# EAGLE schematic 404_led_matrix (EAGLE 7.5.0)
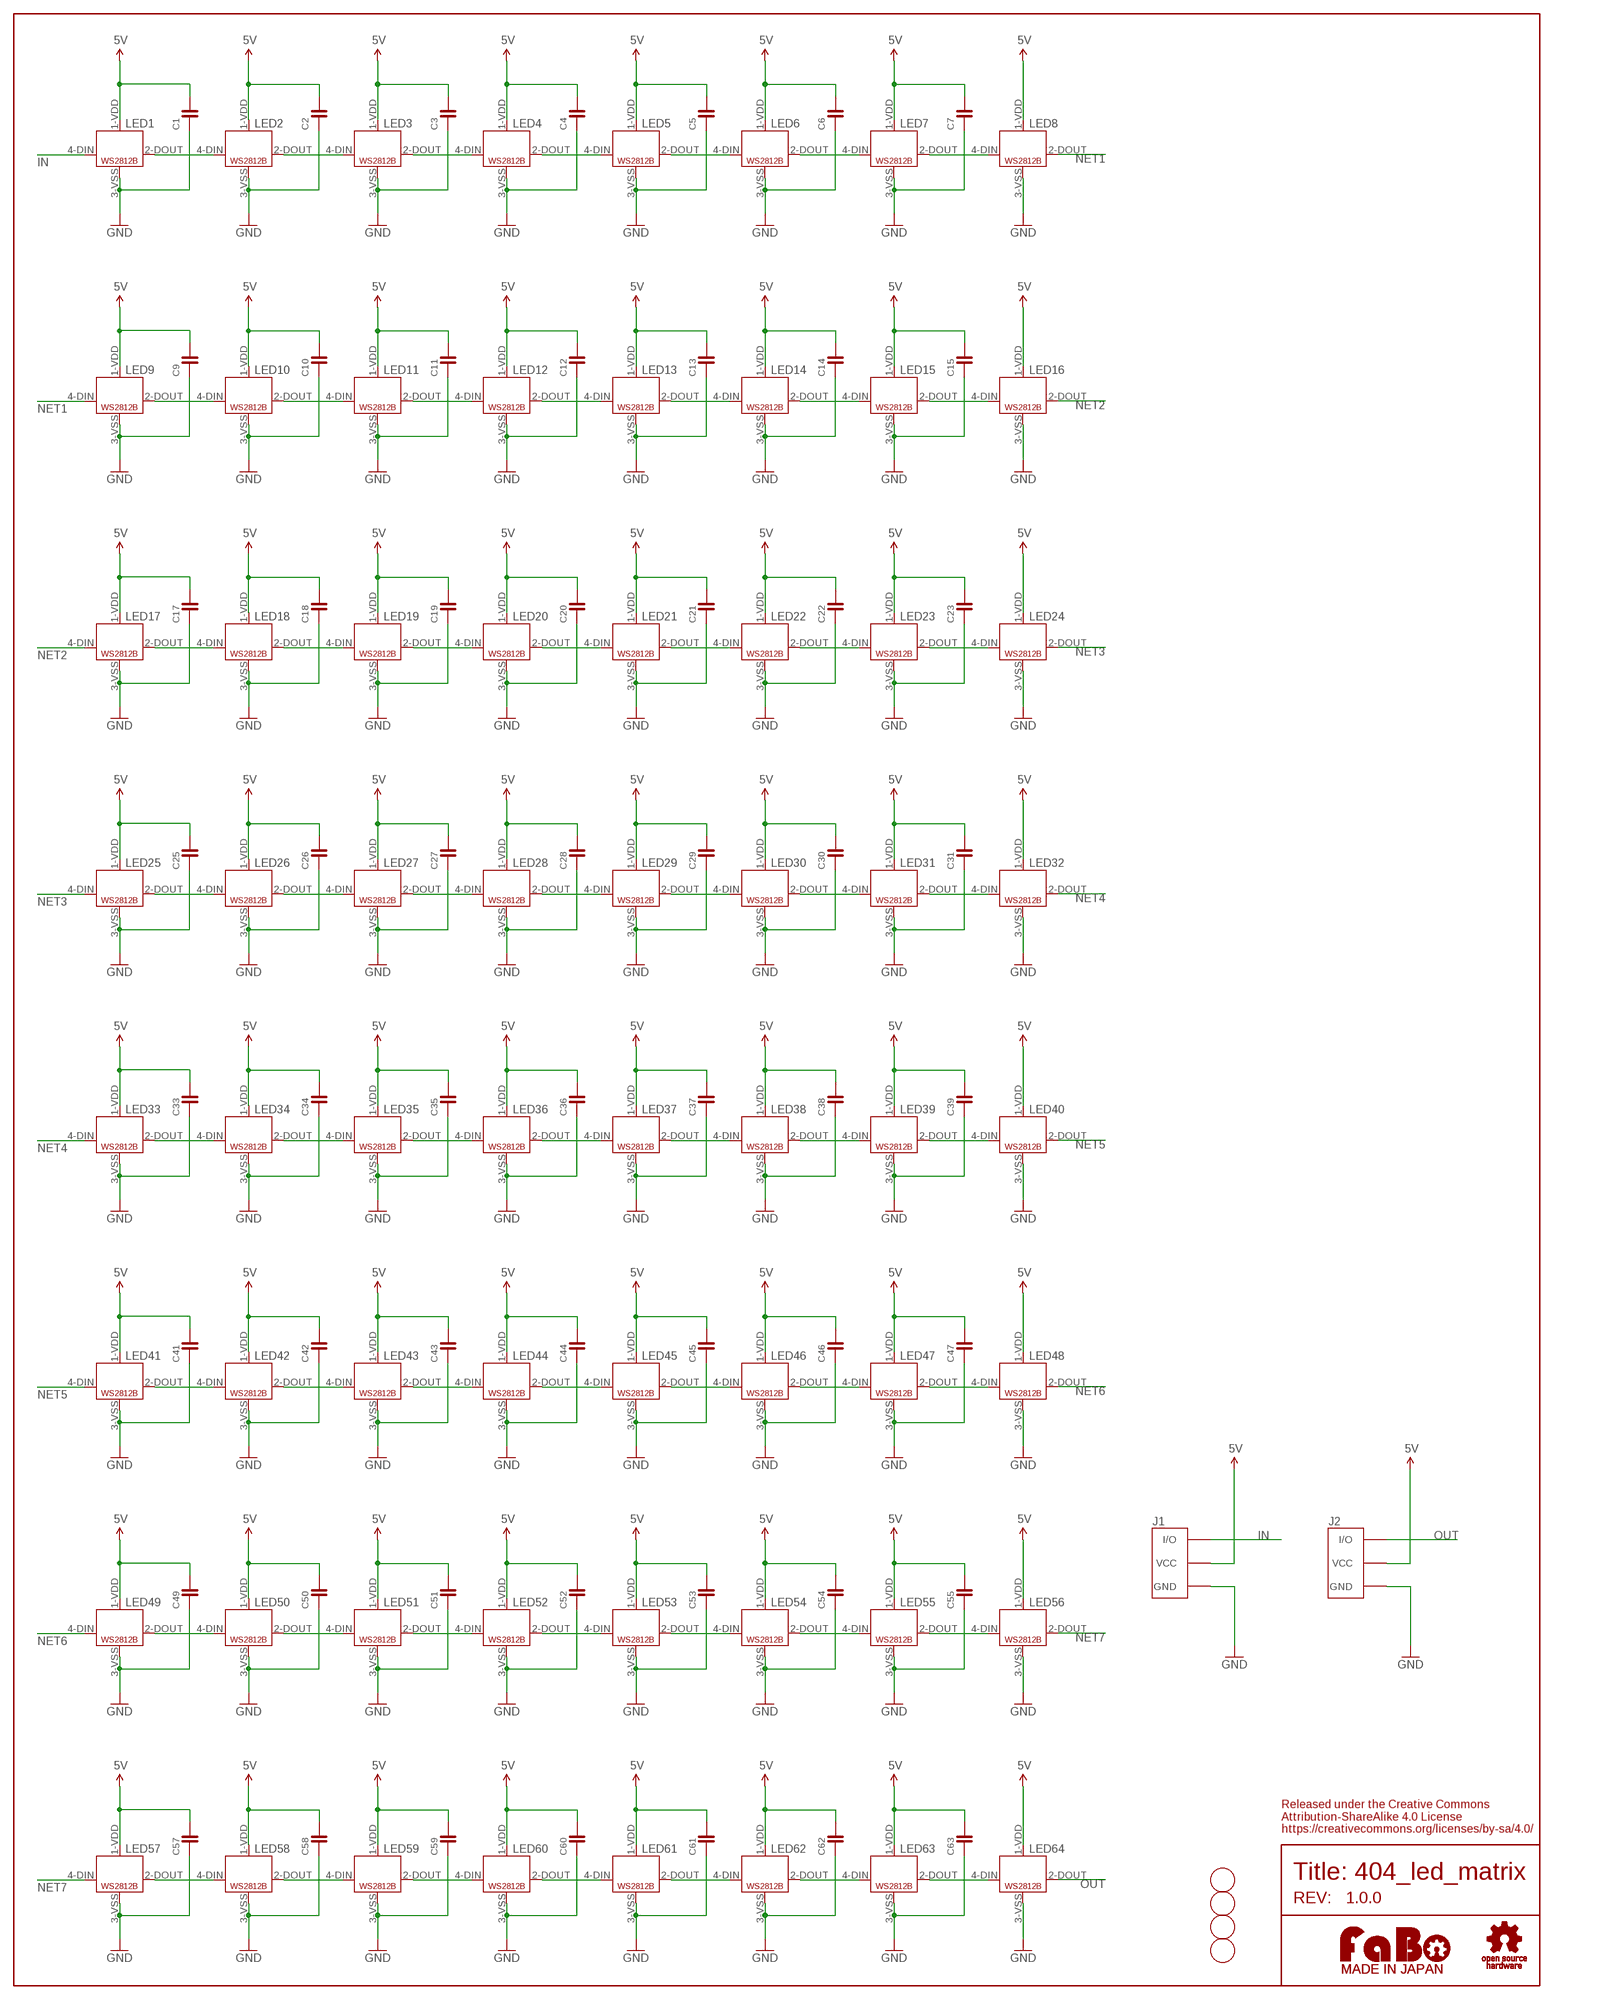
[diagram p0: schematic, sheet 1]

## Parts
C1  CAPACITOR-0603  [0603]
C2  CAPACITOR-0603  [0603]
C3  CAPACITOR-0603  [0603]
C4  CAPACITOR-0603  [0603]
C5  CAPACITOR-0603  [0603]
C6  CAPACITOR-0603  [0603]
C7  CAPACITOR-0603  [0603]
C9  CAPACITOR-0603  [0603]
C10  CAPACITOR-0603  [0603]
C11  CAPACITOR-0603  [0603]
C12  CAPACITOR-0603  [0603]
C13  CAPACITOR-0603  [0603]
C14  CAPACITOR-0603  [0603]
C15  CAPACITOR-0603  [0603]
C17  CAPACITOR-0603  [0603]
C18  CAPACITOR-0603  [0603]
C19  CAPACITOR-0603  [0603]
C20  CAPACITOR-0603  [0603]
C21  CAPACITOR-0603  [0603]
C22  CAPACITOR-0603  [0603]
C23  CAPACITOR-0603  [0603]
C25  CAPACITOR-0603  [0603]
C26  CAPACITOR-0603  [0603]
C27  CAPACITOR-0603  [0603]
C28  CAPACITOR-0603  [0603]
C29  CAPACITOR-0603  [0603]
C30  CAPACITOR-0603  [0603]
C31  CAPACITOR-0603  [0603]
C33  CAPACITOR-0603  [0603]
C34  CAPACITOR-0603  [0603]
C35  CAPACITOR-0603  [0603]
C36  CAPACITOR-0603  [0603]
C37  CAPACITOR-0603  [0603]
C38  CAPACITOR-0603  [0603]
C39  CAPACITOR-0603  [0603]
C41  CAPACITOR-0603  [0603]
C42  CAPACITOR-0603  [0603]
C43  CAPACITOR-0603  [0603]
C44  CAPACITOR-0603  [0603]
C45  CAPACITOR-0603  [0603]
C46  CAPACITOR-0603  [0603]
C47  CAPACITOR-0603  [0603]
C49  CAPACITOR-0603  [0603]
C50  CAPACITOR-0603  [0603]
C51  CAPACITOR-0603  [0603]
C52  CAPACITOR-0603  [0603]
C53  CAPACITOR-0603  [0603]
C54  CAPACITOR-0603  [0603]
C55  CAPACITOR-0603  [0603]
C57  CAPACITOR-0603  [0603]
C58  CAPACITOR-0603  [0603]
C59  CAPACITOR-0603  [0603]
C60  CAPACITOR-0603  [0603]
C61  CAPACITOR-0603  [0603]
C62  CAPACITOR-0603  [0603]
C63  CAPACITOR-0603  [0603]
HOLE1  SCREW-PAD-2.8MM  [SCREWPAD_2.8MM]
HOLE2  SCREW-PAD-2.8MM  [SCREWPAD_2.8MM]
HOLE3  SCREW-PAD-2.8MM  [SCREWPAD_2.8MM]
HOLE4  SCREW-PAD-2.8MM  [SCREWPAD_2.8MM]
J1  FABO_BRICK_3PIN-CONNECTOR_NARROW  [FABO_BRICK_3PIN_CONNECTOR_NARROW]
J2  FABO_BRICK_3PIN-S03B-PASK-2  [FABO_BRICK_3PIN_S03B-PASK-2]
LED1  WS2812B_NARROW  [WS2812B_NARROW]
LED2  WS2812B_NARROW  [WS2812B_NARROW]
LED3  WS2812B_NARROW  [WS2812B_NARROW]
LED4  WS2812B_NARROW  [WS2812B_NARROW]
LED5  WS2812B_NARROW  [WS2812B_NARROW]
LED6  WS2812B_NARROW  [WS2812B_NARROW]
LED7  WS2812B_NARROW  [WS2812B_NARROW]
LED8  WS2812B_NARROW  [WS2812B_NARROW]
LED9  WS2812B_NARROW  [WS2812B_NARROW]
LED10  WS2812B_NARROW  [WS2812B_NARROW]
LED11  WS2812B_NARROW  [WS2812B_NARROW]
LED12  WS2812B_NARROW  [WS2812B_NARROW]
LED13  WS2812B_NARROW  [WS2812B_NARROW]
LED14  WS2812B_NARROW  [WS2812B_NARROW]
LED15  WS2812B_NARROW  [WS2812B_NARROW]
LED16  WS2812B_NARROW  [WS2812B_NARROW]
LED17  WS2812B_NARROW  [WS2812B_NARROW]
LED18  WS2812B_NARROW  [WS2812B_NARROW]
LED19  WS2812B_NARROW  [WS2812B_NARROW]
LED20  WS2812B_NARROW  [WS2812B_NARROW]
LED21  WS2812B_NARROW  [WS2812B_NARROW]
LED22  WS2812B_NARROW  [WS2812B_NARROW]
LED23  WS2812B_NARROW  [WS2812B_NARROW]
LED24  WS2812B_NARROW  [WS2812B_NARROW]
LED25  WS2812B_NARROW  [WS2812B_NARROW]
LED26  WS2812B_NARROW  [WS2812B_NARROW]
LED27  WS2812B_NARROW  [WS2812B_NARROW]
LED28  WS2812B_NARROW  [WS2812B_NARROW]
LED29  WS2812B_NARROW  [WS2812B_NARROW]
LED30  WS2812B_NARROW  [WS2812B_NARROW]
LED31  WS2812B_NARROW  [WS2812B_NARROW]
LED32  WS2812B_NARROW  [WS2812B_NARROW]
LED33  WS2812B_NARROW  [WS2812B_NARROW]
LED34  WS2812B_NARROW  [WS2812B_NARROW]
LED35  WS2812B_NARROW  [WS2812B_NARROW]
LED36  WS2812B_NARROW  [WS2812B_NARROW]
LED37  WS2812B_NARROW  [WS2812B_NARROW]
LED38  WS2812B_NARROW  [WS2812B_NARROW]
LED39  WS2812B_NARROW  [WS2812B_NARROW]
LED40  WS2812B_NARROW  [WS2812B_NARROW]
LED41  WS2812B_NARROW  [WS2812B_NARROW]
LED42  WS2812B_NARROW  [WS2812B_NARROW]
LED43  WS2812B_NARROW  [WS2812B_NARROW]
LED44  WS2812B_NARROW  [WS2812B_NARROW]
LED45  WS2812B_NARROW  [WS2812B_NARROW]
LED46  WS2812B_NARROW  [WS2812B_NARROW]
LED47  WS2812B_NARROW  [WS2812B_NARROW]
LED48  WS2812B_NARROW  [WS2812B_NARROW]
LED49  WS2812B_NARROW  [WS2812B_NARROW]
LED50  WS2812B_NARROW  [WS2812B_NARROW]
LED51  WS2812B_NARROW  [WS2812B_NARROW]
LED52  WS2812B_NARROW  [WS2812B_NARROW]
LED53  WS2812B_NARROW  [WS2812B_NARROW]
LED54  WS2812B_NARROW  [WS2812B_NARROW]
LED55  WS2812B_NARROW  [WS2812B_NARROW]
LED56  WS2812B_NARROW  [WS2812B_NARROW]
LED57  WS2812B_NARROW  [WS2812B_NARROW]
LED58  WS2812B_NARROW  [WS2812B_NARROW]
LED59  WS2812B_NARROW  [WS2812B_NARROW]
LED60  WS2812B_NARROW  [WS2812B_NARROW]
LED61  WS2812B_NARROW  [WS2812B_NARROW]
LED62  WS2812B_NARROW  [WS2812B_NARROW]
LED63  WS2812B_NARROW  [WS2812B_NARROW]
LED64  WS2812B_NARROW  [WS2812B_NARROW]
U$1  LOGO_OSHW-T_M_BOTTOM  [LOGO_OSHW_T_MS_BOTTOM]
U$2  LOGO_FABO-L_BOTTOM  [LOGO_FABO_L_BOTTOM]
U$4  LOGO_FABO-S  [LOGO_FABO_S]

## Nets
5V: C1.2 C2.2 C3.2 C4.2 C5.2 C6.2 C7.2 C9.2 C10.2 C11.2 C12.2 C13.2 C14.2 C15.2 C17.2 C18.2 C19.2 C20.2 C21.2 C22.2 C23.2 C25.2 C26.2 C27.2 C28.2 C29.2 C30.2 C31.2 C33.2 C34.2 C35.2 C36.2 C37.2 C38.2 C39.2 C41.2 C42.2 C43.2 C44.2 C45.2 C46.2 C47.2 C49.2 C50.2 C51.2 C52.2 C53.2 C54.2 C55.2 C57.2 C58.2 C59.2 C60.2 C61.2 C62.2 C63.2 J1.VCC J2.VCC LED1.1-VDD(VDD) LED2.1-VDD(VDD) LED3.1-VDD(VDD) LED4.1-VDD(VDD) LED5.1-VDD(VDD) LED6.1-VDD(VDD) LED7.1-VDD(VDD) LED8.1-VDD(VDD) LED9.1-VDD(VDD) LED10.1-VDD(VDD) LED11.1-VDD(VDD) LED12.1-VDD(VDD) LED13.1-VDD(VDD) LED14.1-VDD(VDD) LED15.1-VDD(VDD) LED16.1-VDD(VDD) LED17.1-VDD(VDD) LED18.1-VDD(VDD) LED19.1-VDD(VDD) LED20.1-VDD(VDD) LED21.1-VDD(VDD) LED22.1-VDD(VDD) LED23.1-VDD(VDD) LED24.1-VDD(VDD) LED25.1-VDD(VDD) LED26.1-VDD(VDD) LED27.1-VDD(VDD) LED28.1-VDD(VDD) LED29.1-VDD(VDD) LED30.1-VDD(VDD) LED31.1-VDD(VDD) LED32.1-VDD(VDD) LED33.1-VDD(VDD) LED34.1-VDD(VDD) LED35.1-VDD(VDD) LED36.1-VDD(VDD) LED37.1-VDD(VDD) LED38.1-VDD(VDD) LED39.1-VDD(VDD) LED40.1-VDD(VDD) LED41.1-VDD(VDD) LED42.1-VDD(VDD) LED43.1-VDD(VDD) LED44.1-VDD(VDD) LED45.1-VDD(VDD) LED46.1-VDD(VDD) LED47.1-VDD(VDD) LED48.1-VDD(VDD) LED49.1-VDD(VDD) LED50.1-VDD(VDD) LED51.1-VDD(VDD) LED52.1-VDD(VDD) LED53.1-VDD(VDD) LED54.1-VDD(VDD) LED55.1-VDD(VDD) LED56.1-VDD(VDD) LED57.1-VDD(VDD) LED58.1-VDD(VDD) LED59.1-VDD(VDD) LED60.1-VDD(VDD) LED61.1-VDD(VDD) LED62.1-VDD(VDD) LED63.1-VDD(VDD) LED64.1-VDD(VDD)
GND: C1.1 C2.1 C3.1 C4.1 C5.1 C6.1 C7.1 C9.1 C10.1 C11.1 C12.1 C13.1 C14.1 C15.1 C17.1 C18.1 C19.1 C20.1 C21.1 C22.1 C23.1 C25.1 C26.1 C27.1 C28.1 C29.1 C30.1 C31.1 C33.1 C34.1 C35.1 C36.1 C37.1 C38.1 C39.1 C41.1 C42.1 C43.1 C44.1 C45.1 C46.1 C47.1 C49.1 C50.1 C51.1 C52.1 C53.1 C54.1 C55.1 C57.1 C58.1 C59.1 C60.1 C61.1 C62.1 C63.1 J1.GND J2.GND LED1.3-VSS(VSS) LED2.3-VSS(VSS) LED3.3-VSS(VSS) LED4.3-VSS(VSS) LED5.3-VSS(VSS) LED6.3-VSS(VSS) LED7.3-VSS(VSS) LED8.3-VSS(VSS) LED9.3-VSS(VSS) LED10.3-VSS(VSS) LED11.3-VSS(VSS) LED12.3-VSS(VSS) LED13.3-VSS(VSS) LED14.3-VSS(VSS) LED15.3-VSS(VSS) LED16.3-VSS(VSS) LED17.3-VSS(VSS) LED18.3-VSS(VSS) LED19.3-VSS(VSS) LED20.3-VSS(VSS) LED21.3-VSS(VSS) LED22.3-VSS(VSS) LED23.3-VSS(VSS) LED24.3-VSS(VSS) LED25.3-VSS(VSS) LED26.3-VSS(VSS) LED27.3-VSS(VSS) LED28.3-VSS(VSS) LED29.3-VSS(VSS) LED30.3-VSS(VSS) LED31.3-VSS(VSS) LED32.3-VSS(VSS) LED33.3-VSS(VSS) LED34.3-VSS(VSS) LED35.3-VSS(VSS) LED36.3-VSS(VSS) LED37.3-VSS(VSS) LED38.3-VSS(VSS) LED39.3-VSS(VSS) LED40.3-VSS(VSS) LED41.3-VSS(VSS) LED42.3-VSS(VSS) LED43.3-VSS(VSS) LED44.3-VSS(VSS) LED45.3-VSS(VSS) LED46.3-VSS(VSS) LED47.3-VSS(VSS) LED48.3-VSS(VSS) LED49.3-VSS(VSS) LED50.3-VSS(VSS) LED51.3-VSS(VSS) LED52.3-VSS(VSS) LED53.3-VSS(VSS) LED54.3-VSS(VSS) LED55.3-VSS(VSS) LED56.3-VSS(VSS) LED57.3-VSS(VSS) LED58.3-VSS(VSS) LED59.3-VSS(VSS) LED60.3-VSS(VSS) LED61.3-VSS(VSS) LED62.3-VSS(VSS) LED63.3-VSS(VSS) LED64.3-VSS(VSS)
IN: J1.IN/OUT(I/O) LED1.4-DIN(DIN)
N$1: LED3.2-DOUT(DOUT) LED4.4-DIN(DIN)
N$2: LED4.2-DOUT(DOUT) LED5.4-DIN(DIN)
N$3: LED5.2-DOUT(DOUT) LED6.4-DIN(DIN)
N$4: LED6.2-DOUT(DOUT) LED7.4-DIN(DIN)
N$5: LED1.2-DOUT(DOUT) LED2.4-DIN(DIN)
N$6: LED7.2-DOUT(DOUT) LED8.4-DIN(DIN)
N$7: LED9.2-DOUT(DOUT) LED10.4-DIN(DIN)
N$8: LED10.2-DOUT(DOUT) LED11.4-DIN(DIN)
N$9: LED11.2-DOUT(DOUT) LED12.4-DIN(DIN)
N$10: LED12.2-DOUT(DOUT) LED13.4-DIN(DIN)
N$11: LED13.2-DOUT(DOUT) LED14.4-DIN(DIN)
N$12: LED14.2-DOUT(DOUT) LED15.4-DIN(DIN)
N$13: LED15.2-DOUT(DOUT) LED16.4-DIN(DIN)
N$14: LED17.2-DOUT(DOUT) LED18.4-DIN(DIN)
N$15: LED18.2-DOUT(DOUT) LED19.4-DIN(DIN)
N$16: LED19.2-DOUT(DOUT) LED20.4-DIN(DIN)
N$17: LED20.2-DOUT(DOUT) LED21.4-DIN(DIN)
N$18: LED21.2-DOUT(DOUT) LED22.4-DIN(DIN)
N$19: LED22.2-DOUT(DOUT) LED23.4-DIN(DIN)
N$20: LED23.2-DOUT(DOUT) LED24.4-DIN(DIN)
N$21: LED25.2-DOUT(DOUT) LED26.4-DIN(DIN)
N$22: LED26.2-DOUT(DOUT) LED27.4-DIN(DIN)
N$23: LED27.2-DOUT(DOUT) LED28.4-DIN(DIN)
N$24: LED28.2-DOUT(DOUT) LED29.4-DIN(DIN)
N$25: LED29.2-DOUT(DOUT) LED30.4-DIN(DIN)
N$26: LED30.2-DOUT(DOUT) LED31.4-DIN(DIN)
N$27: LED31.2-DOUT(DOUT) LED32.4-DIN(DIN)
N$28: LED33.2-DOUT(DOUT) LED34.4-DIN(DIN)
N$29: LED34.2-DOUT(DOUT) LED35.4-DIN(DIN)
N$30: LED35.2-DOUT(DOUT) LED36.4-DIN(DIN)
N$31: LED36.2-DOUT(DOUT) LED37.4-DIN(DIN)
N$32: LED37.2-DOUT(DOUT) LED38.4-DIN(DIN)
N$33: LED38.2-DOUT(DOUT) LED39.4-DIN(DIN)
N$34: LED39.2-DOUT(DOUT) LED40.4-DIN(DIN)
N$35: LED41.2-DOUT(DOUT) LED42.4-DIN(DIN)
N$36: LED42.2-DOUT(DOUT) LED43.4-DIN(DIN)
N$37: LED43.2-DOUT(DOUT) LED44.4-DIN(DIN)
N$38: LED44.2-DOUT(DOUT) LED45.4-DIN(DIN)
N$39: LED45.2-DOUT(DOUT) LED46.4-DIN(DIN)
N$40: LED46.2-DOUT(DOUT) LED47.4-DIN(DIN)
N$41: LED47.2-DOUT(DOUT) LED48.4-DIN(DIN)
N$42: LED49.2-DOUT(DOUT) LED50.4-DIN(DIN)
N$43: LED50.2-DOUT(DOUT) LED51.4-DIN(DIN)
N$44: LED51.2-DOUT(DOUT) LED52.4-DIN(DIN)
N$45: LED52.2-DOUT(DOUT) LED53.4-DIN(DIN)
N$46: LED53.2-DOUT(DOUT) LED54.4-DIN(DIN)
N$47: LED54.2-DOUT(DOUT) LED55.4-DIN(DIN)
N$48: LED55.2-DOUT(DOUT) LED56.4-DIN(DIN)
N$49: LED57.2-DOUT(DOUT) LED58.4-DIN(DIN)
N$50: LED58.2-DOUT(DOUT) LED59.4-DIN(DIN)
N$51: LED59.2-DOUT(DOUT) LED60.4-DIN(DIN)
N$52: LED60.2-DOUT(DOUT) LED61.4-DIN(DIN)
N$53: LED61.2-DOUT(DOUT) LED62.4-DIN(DIN)
N$54: LED62.2-DOUT(DOUT) LED63.4-DIN(DIN)
N$55: LED63.2-DOUT(DOUT) LED64.4-DIN(DIN)
N$60: LED2.2-DOUT(DOUT) LED3.4-DIN(DIN)
NET1: LED8.2-DOUT(DOUT) LED9.4-DIN(DIN)
NET2: LED16.2-DOUT(DOUT) LED17.4-DIN(DIN)
NET3: LED24.2-DOUT(DOUT) LED25.4-DIN(DIN)
NET4: LED32.2-DOUT(DOUT) LED33.4-DIN(DIN)
NET5: LED40.2-DOUT(DOUT) LED41.4-DIN(DIN)
NET6: LED48.2-DOUT(DOUT) LED49.4-DIN(DIN)
NET7: LED56.2-DOUT(DOUT) LED57.4-DIN(DIN)
OUT: J2.I/O LED64.2-DOUT(DOUT)

## Notes on the sheet
- Released under the Creative Commons
  Attribution-ShareAlike 4.0 License
  https://creativecommons.org/licenses/by-sa/4.0/
- Title: 404_led_matrix
- REV: | 1.0.0

## Library data of the parts
C1-C7 C9-C15 C17-C23 C25-C31 C33-C39 C41-C47 C49-C55 C57-C63 = FaBo-Capacitor:CAPACITOR: CAPACITOR
HOLE1-HOLE4 = FaBo-etc:SCREW-PAD
J1 J2 = FaBo-Template:FABO_BRICK_3PIN: FaBo Brick 3pin
LED1-LED64 = FaBo-LED:WS2812B_NARROW
U$1 = FaBo-etc:LOGO_OSHW
U$2 U$4 = FaBo-etc:LOGO_FABO